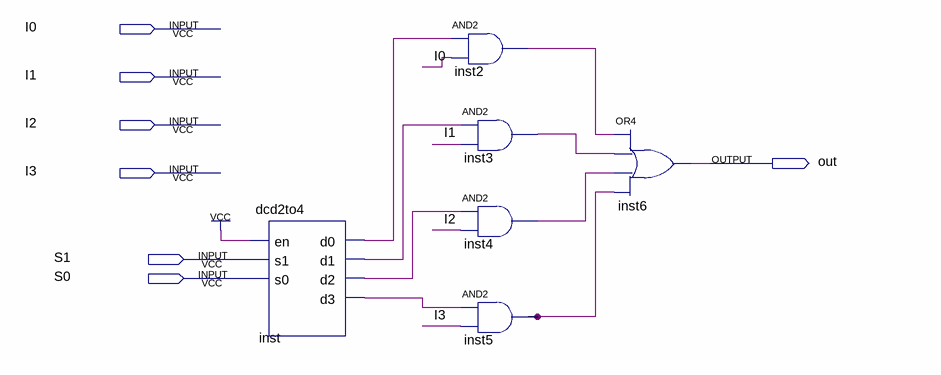
[diagram p0: schematic sheet]
// Quartus schematic mux4to1.bdf as structural Verilog: 6 symbols, 7 pins
module mux4to1 (
  input  I0,
  input  I1,
  input  I2,
  input  I3,
  input  S1,
  input  S0,
  output out
);

  wire inst2_out, inst3_out, inst4_out, inst5_out, inst_d0, inst_d1, inst_d2, inst_d3;

  dcd2to4 inst (.en(1'b1), .s1(S1), .s0(S0), .d0(inst_d0), .d1(inst_d1), .d2(inst_d2), .d3(inst_d3));
  and inst2 (inst2_out, inst_d0, I0);
  and inst3 (inst3_out, inst_d1, I1);
  and inst4 (inst4_out, inst_d2, I2);
  and inst5 (inst5_out, inst_d3, I3);
  or inst6 (out, inst2_out, inst3_out, inst4_out, inst5_out);
endmodule
